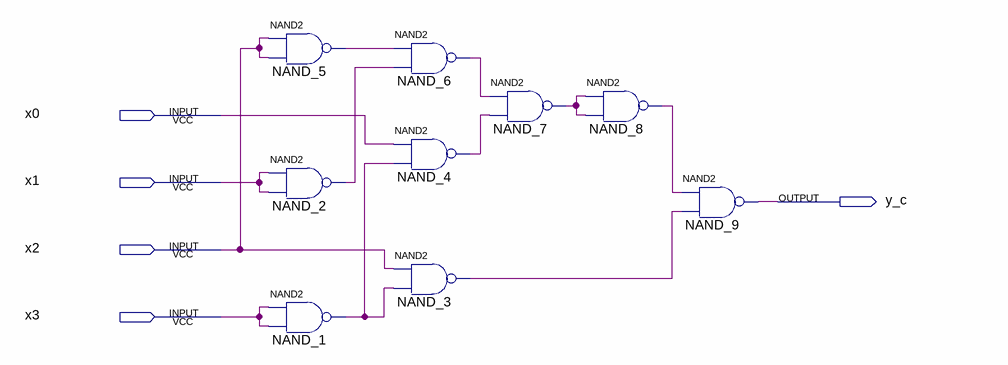
[diagram p0: schematic sheet]
// Quartus schematic c_schema.bdf as structural Verilog: 9 symbols, 5 pins
module c_schema (
  input  x0,
  input  x1,
  input  x2,
  input  x3,
  output y_c
);

  wire NAND_1_out, NAND_2_out, NAND_3_out, NAND_4_out, NAND_5_out, NAND_6_out, NAND_7_out, NAND_8_out;

  nand NAND_5 (NAND_5_out, x2, x2);
  nand NAND_2 (NAND_2_out, x1, x1);
  nand NAND_1 (NAND_1_out, x3, x3);
  nand NAND_6 (NAND_6_out, NAND_5_out, NAND_2_out);
  nand NAND_4 (NAND_4_out, x0, NAND_1_out);
  nand NAND_3 (NAND_3_out, x2, NAND_1_out);
  nand NAND_7 (NAND_7_out, NAND_6_out, NAND_4_out);
  nand NAND_8 (NAND_8_out, NAND_7_out, NAND_7_out);
  nand NAND_9 (y_c, NAND_8_out, NAND_3_out);
endmodule
